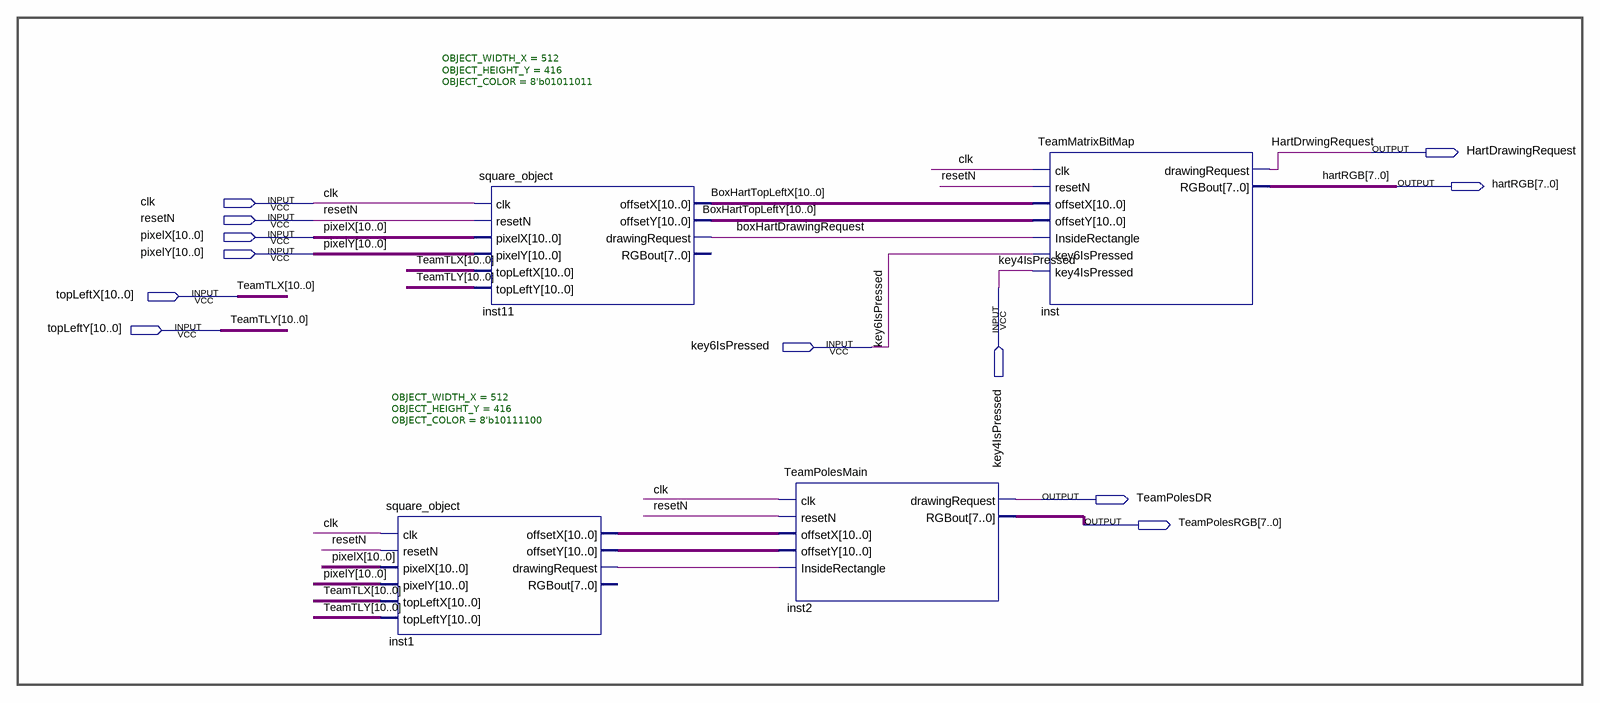
[diagram p0: schematic sheet]
// Quartus schematic HART_DISPLAY.bdf as structural Verilog: 4 symbols, 12 pins
module HART_DISPLAY (
  input  clk,
  input  resetN,
  input  [10:0] pixelX,
  input  [10:0] pixelY,
  input  key4IsPressed,
  input  [10:0] topLeftX,
  input  [10:0] topLeftY,
  input  key6IsPressed,
  output HartDrawingRequest,
  output [7:0] hartRGB,
  output TeamPolesDR,
  output [7:0] TeamPolesRGB
);

  wire boxHartDrawingRequest, inst1_drawingrequest;
  wire [10:0] BoxHartTopLeftX, BoxHartTopLeftY, inst1_offsetx, inst1_offsety;

  square_object #(.OBJECT_WIDTH_X(512), .OBJECT_HEIGHT_Y(416), .OBJECT_COLOR(8'b10111100)) inst1 (
    .clk(clk), .resetN(resetN), .pixelX(pixelX), .pixelY(pixelY), .topLeftX(topLeftX), .topLeftY(topLeftY),
    .offsetX(inst1_offsetx), .offsetY(inst1_offsety), .drawingRequest(inst1_drawingrequest));  // open: RGBout
  square_object #(.OBJECT_WIDTH_X(512), .OBJECT_HEIGHT_Y(416), .OBJECT_COLOR(8'b01011011)) inst11 (
    .clk(clk), .resetN(resetN), .pixelX(pixelX), .pixelY(pixelY), .topLeftX(topLeftX), .topLeftY(topLeftY),
    .offsetX(BoxHartTopLeftX), .offsetY(BoxHartTopLeftY), .drawingRequest(boxHartDrawingRequest));  // open: RGBout
  TeamPolesMain inst2 (
    .clk(clk), .resetN(resetN), .offsetX(inst1_offsetx), .offsetY(inst1_offsety),
    .InsideRectangle(inst1_drawingrequest), .drawingRequest(TeamPolesDR), .RGBout(TeamPolesRGB));
  TeamMatrixBitMap inst (
    .clk(clk), .resetN(resetN), .offsetX(BoxHartTopLeftX), .offsetY(BoxHartTopLeftY),
    .InsideRectangle(boxHartDrawingRequest), .key6IsPressed(key6IsPressed), .key4IsPressed(key4IsPressed),
    .drawingRequest(HartDrawingRequest), .RGBout(hartRGB));

  // Other names for the same wires on the sheet: HartDrwingRequest = HartDrawingRequest; TeamTLX[10:0] = topLeftX;
  //   TeamTLY[10:0] = topLeftY
endmodule
